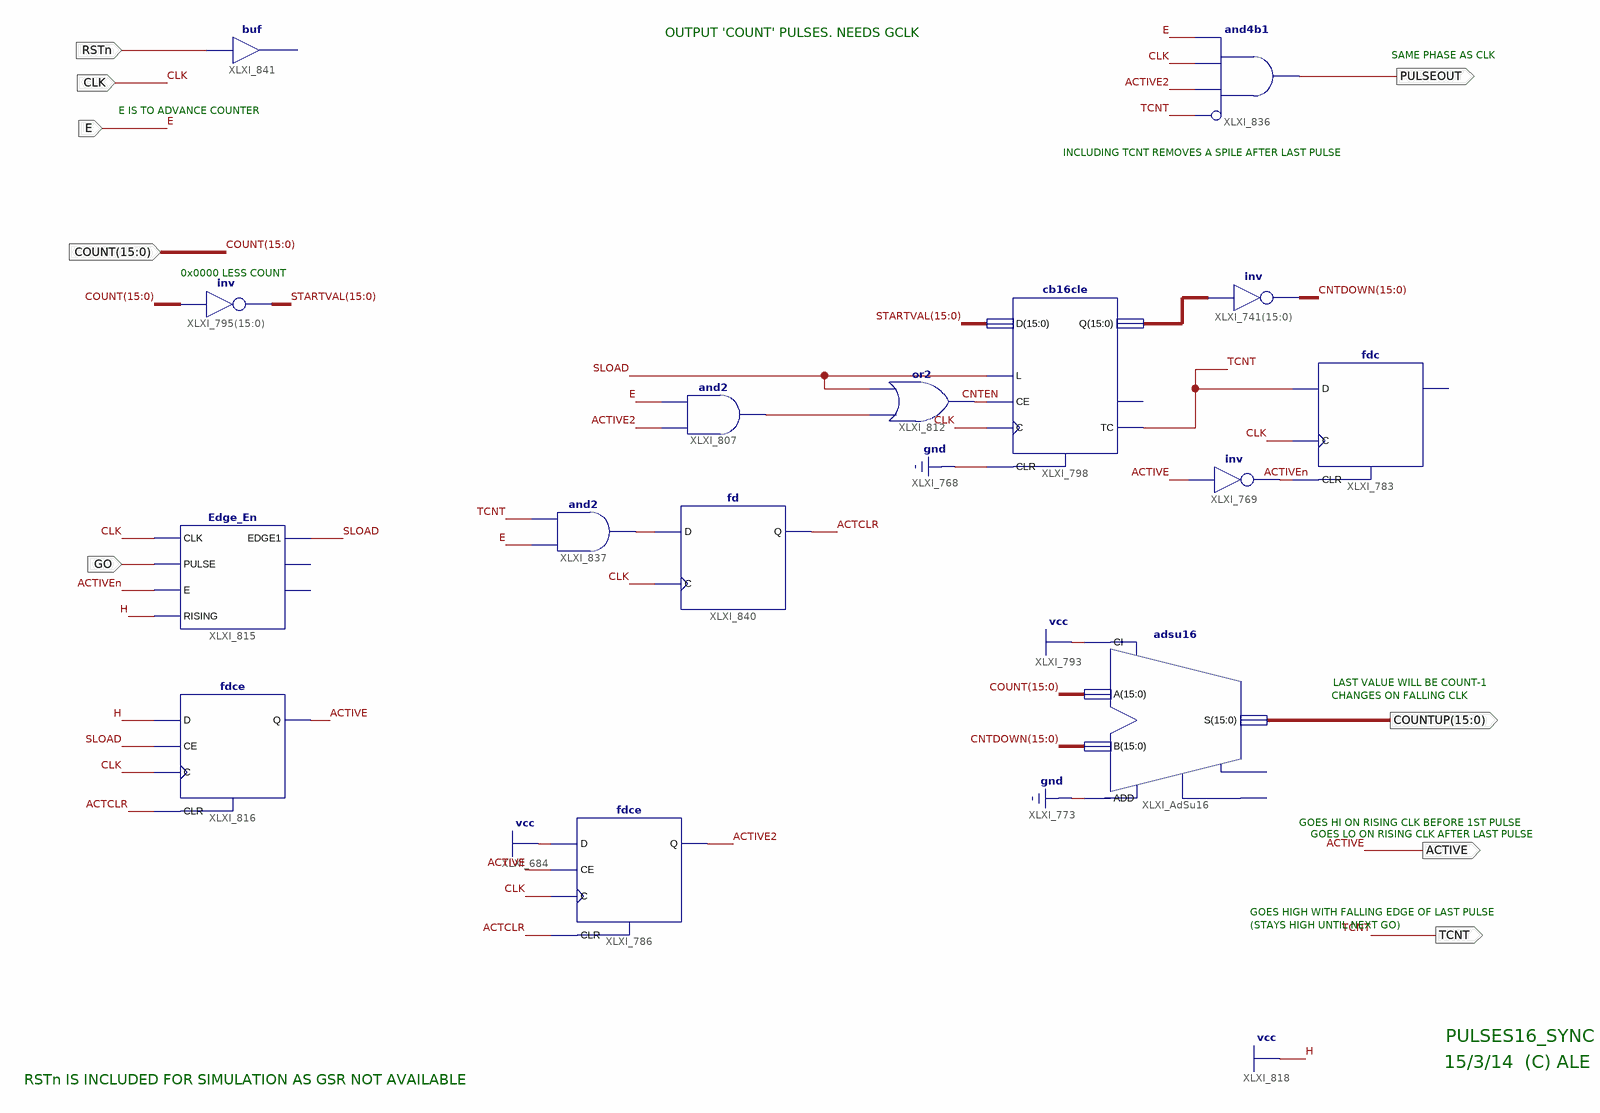
[diagram p0: schematic sheet 1]
// Xilinx ISE schematic DB_Pulses16_sync.sch (spartan3e) as structural Verilog: 15 symbols, 9 ports
module DB_Pulses16_sync (
  input  RSTn,
  input  CLK,
  input  [15:0] COUNT,
  input  GO,
  input  E,
  output ACTIVE,
  output TCNT,
  output [15:0] COUNTUP,
  output PULSEOUT
);

  wire ACTCLR, ACTIVE2, ACTIVEn, CNTEN, SLOAD, XLXN_304, XLXN_394;
  wire [15:0] CNTDOWN, STARTVAL, XLXN_192;

  not XLXI_769 (ACTIVEn, ACTIVE);
  assign CNTDOWN = ~XLXN_192;  // inv XLXI_741[15..0], 16 bits wide
  fdc XLXI_783 (.C(CLK), .CLR(ACTIVEn), .D(TCNT));  // open: Q
  adsu16 XLXI_AdSu16 (.A(COUNT), .ADD(1'b0), .B(CNTDOWN), .CI(1'b1), .S(COUNTUP));  // open: CO, OFL
  cb16cle XLXI_798 (.C(CLK), .CE(CNTEN), .CLR(1'b0), .D(STARTVAL), .L(SLOAD), .Q(XLXN_192), .TC(TCNT));  // open: CEO
  or XLXI_812 (CNTEN, XLXN_304, SLOAD);
  and XLXI_807 (XLXN_304, ACTIVE2, E);
  Edge_En XLXI_815 (.CLK(CLK), .E(ACTIVEn), .EDGE1(SLOAD), .PULSE(GO), .RISING(1'b1));  // open: EDGE0, EDGEQUICK
  fdce XLXI_816 (.C(CLK), .CE(SLOAD), .CLR(ACTCLR), .D(1'b1), .Q(ACTIVE));
  fdce XLXI_786 (.C(CLK), .CE(ACTIVE), .CLR(ACTCLR), .D(1'b1), .Q(ACTIVE2));
  assign STARTVAL = ~COUNT;  // inv XLXI_795[15..0], 16 bits wide
  and XLXI_836 (PULSEOUT, ~TCNT, ACTIVE2, CLK, E);  // and4b1
  and XLXI_837 (XLXN_394, E, TCNT);
  fd XLXI_840 (.C(CLK), .D(XLXN_394), .Q(ACTCLR));
  // buf XLXI_841 has open pins: I=RSTn, O=open

  // Notes on the sheet:
  //   OUTPUT 'COUNT' PULSES. NEEDS GCLK
  //   SAME PHASE AS CLK
  //   E IS TO ADVANCE COUNTER
  //   INCLUDING TCNT REMOVES A SPILE AFTER LAST PULSE
  //   0x0000 LESS COUNT
  //   LAST VALUE WILL BE COUNT-1
  //   CHANGES ON FALLING CLK
  //   GOES HI ON RISING CLK BEFORE 1ST PULSE
  //   GOES LO ON RISING CLK AFTER LAST PULSE
  //   GOES HIGH WITH FALLING EDGE OF LAST PULSE
  //   (STAYS HIGH UNTIL NEXT GO)
  //   PULSES16_SYNC
  //   15/3/14  (C) ALE
  //   RSTn IS INCLUDED FOR SIMULATION AS GSR NOT AVAILABLE
endmodule
